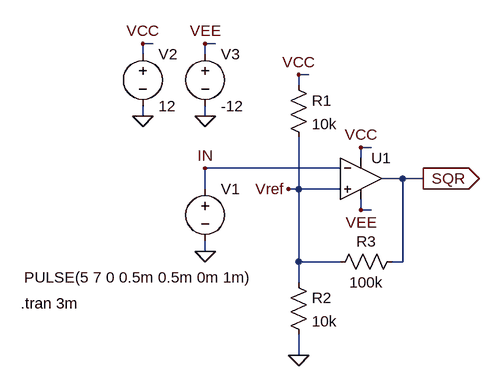
[diagram p0: schematic Hysteresis_Comparator.asc]
Hysteresis_Comparator.asc, the LTspice schematic file:
Version 4
SHEET 1 880 680
WIRE -80 -64 -96 -64
WIRE 16 -64 0 -64
WIRE -96 -48 -96 -64
WIRE 0 -48 0 -64
WIRE 160 -16 144 -16
WIRE 144 0 144 -16
WIRE -96 48 -96 32
WIRE 0 48 0 32
WIRE 256 96 240 96
WIRE 240 112 240 96
WIRE 208 128 0 128
WIRE 304 144 272 144
WIRE 336 144 304 144
WIRE 0 160 0 128
WIRE 144 160 144 80
WIRE 144 160 128 160
WIRE 208 160 144 160
WIRE 240 192 240 176
WIRE 256 192 240 192
WIRE 0 256 0 240
WIRE 144 272 144 160
WIRE 208 272 144 272
WIRE 304 272 304 144
WIRE 304 272 288 272
WIRE 144 304 144 272
WIRE 144 416 144 384
FLAG 0 256 0
FLAG 240 96 VCC
FLAG 240 192 VEE
FLAG 144 416 0
FLAG 336 144 SQR
IOPIN 336 144 Out
FLAG 144 -16 VCC
FLAG -96 48 0
FLAG 0 48 0
FLAG -96 -64 VCC
FLAG 0 -64 VEE
FLAG 0 128 IN
FLAG 128 160 Vref
SYMBOL Opamps\\UniversalOpamp2 240 144 R0
SYMATTR InstName U1
SYMBOL res 128 -16 R0
SYMATTR InstName R1
SYMATTR Value 10k
SYMBOL voltage 0 144 R0
WINDOW 3 -279 152 Left 2
WINDOW 123 0 0 Left 2
WINDOW 39 0 0 Left 2
SYMATTR InstName V1
SYMATTR Value PULSE(5 7 0 0.5m 0.5m 0m 1m)
SYMBOL res 128 288 R0
SYMATTR InstName R2
SYMATTR Value 10k
SYMBOL res 304 256 R90
WINDOW 0 0 56 VBottom 2
WINDOW 3 32 56 VTop 2
SYMATTR InstName R3
SYMATTR Value 100k
SYMBOL voltage -96 -64 R0
WINDOW 123 0 0 Left 2
WINDOW 39 0 0 Left 2
SYMATTR InstName V2
SYMATTR Value 12
SYMBOL voltage 0 -64 R0
WINDOW 123 0 0 Left 2
WINDOW 39 0 0 Left 2
SYMATTR InstName V3
SYMATTR Value -12
TEXT -284 336 Left 2 !.tran 3m

The netlist it stands for:
* Hysteresis_Comparator.asc
XU1 Vref IN VCC VEE SQR level.2 Avol=1Meg GBW=10Meg Slew=10Meg ilimit=25m rail=0 Vos=0 phimargin=45 en=0 enk=0 in=0 ink=0 Rin=500Meg  ; pins IN+ IN- V+ V- OUT
R1 VCC Vref 10k
V1 IN 0 PULSE(5 7 0 0.5m 0.5m 0m 1m)
R2 Vref 0 10k
R3 SQR Vref 100k
V2 VCC 0 12
V3 VEE 0 -12
.tran 3m
.lib UniversalOpamps2.sub
.backanno
.end